# EAGLE design Servorino_FT230X_brick_logic (EAGLE 9.6.2)
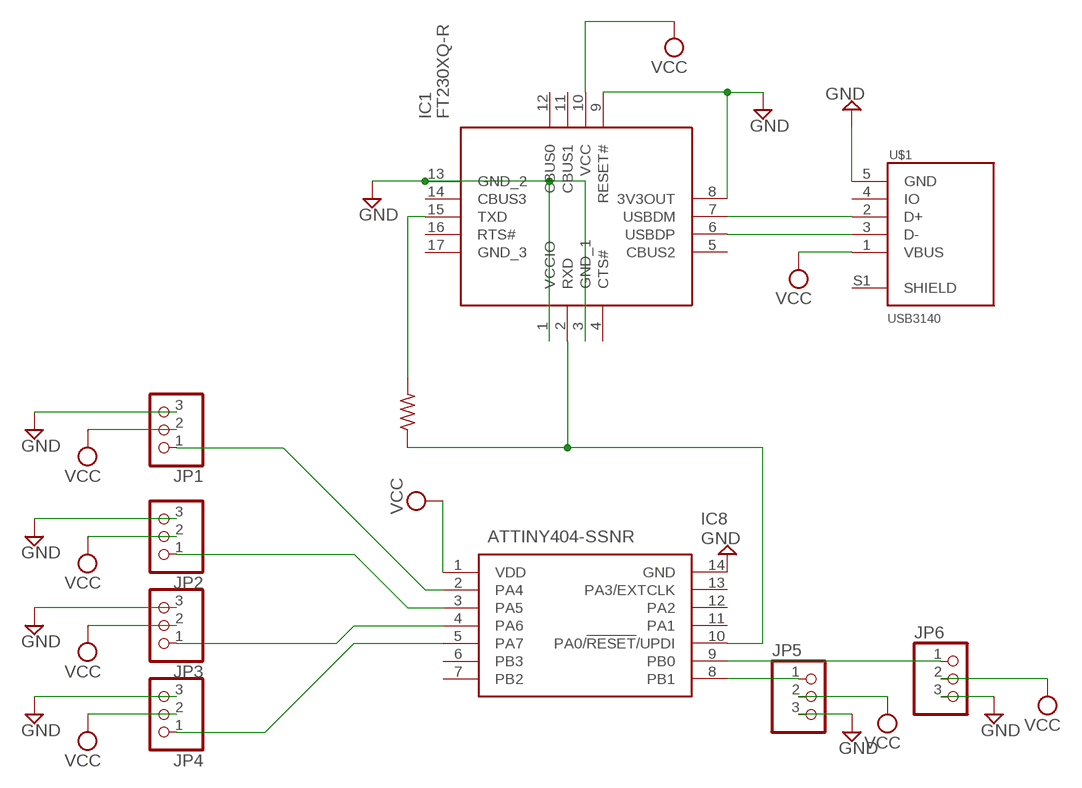
[diagram p0: schematic, sheet 1]

## Parts
IC1  FT230XQ-R  [QFN65P400X400X80-17N]
IC8  ATTINY404-SSNR  [SOIC127P600X175-14N]
JP1  PINHD-1X3  [1X03]
JP2  PINHD-1X3  [1X03]
JP3  PINHD-1X3  [1X03]
JP4  PINHD-1X3  [1X03]
JP5  PINHD-1X3  [1X03]
JP6  PINHD-1X3  [1X03]
R6  470  R-US_R0805  [R0805]
U$1  USB3140  [USB3140-30-0170-0-C]

## Nets
GND: IC1.1(VCCIO) IC1.3(GND_1) IC1.8(3V3OUT) IC1.9(RESET#) IC1.13(GND_2) IC8.14(GND) JP1.3 JP2.3 JP3.3 JP4.3 JP5.3 JP6.3 U$1.5(GND)
N$1: IC8.2(PA4) JP1.1
N$2: IC8.9(PB0) JP6.1
N$3: IC8.8(PB1) JP5.1
N$4: IC8.3(PA5) JP2.1
N$5: IC8.4(PA6) JP3.1
N$6: IC8.5(PA7) JP4.1
N$11: IC1.15(TXD) R6.2
N$12: IC1.6(USBDP) U$1.3(D-)
N$13: IC1.2(RXD) IC8.10(PA0/!RESET!/UPDI) R6.1
N$14: IC1.7(USBDM) U$1.2(D+)
VCC: IC1.10(VCC) IC8.1(VDD) JP1.2 JP2.2 JP3.2 JP4.2 JP5.2 JP6.2 U$1.1(VBUS)
Unconnected: IC1.4(CTS#) IC1.5(CBUS2) IC1.11(CBUS1) IC1.12(CBUS0) IC1.14(CBUS3) IC1.16(RTS#) IC1.17(GND_3) IC8.6(PB3) IC8.7(PB2) IC8.11(PA1) IC8.12(PA2) IC8.13(PA3/EXTCLK) U$1.4(IO) U$1.S1(SHIELD)

## Library data of the parts
IC1 = SamacSys_Parts:FT230XQ-R: X-Chip USB to Basic UART Interface FTDI Chip FT230XQ-R UART Interface 3MBd, 5 V, 16-Pin, QFN Source: Datasheet <https://componentsearchengine.com/Datasheets/1/FT230XQ-R.pdf>; DESCRIPTION: X-Chip USB to Basic UART Interface FTDI Chip FT230XQ-R UART Interface 3MBd, 5 V, 16-Pin, QFN; HEIGHT: 0.8mm; MANUFACTURER_NAME: FTDI Chip; MANUFACTURER_PART_NUMBER: FT230XQ-R; MOUSER_PART_NUMBER: 895-FT230XQ-R; MOUSER_PRICE-STOCK: https://www.mouser.co.uk/ProductDetail/FTDI/FT230XQ-R?qs=Gp1Yz1mis3VvmXwyDmIHOg%3D%3D
IC8 = SamacSys_Parts:ATTINY404-SSNR: MICROCHIP - ATTINY404-SSNR - MCU, 8BIT, 20MHZ, SOIC-14 Source: Datasheet <https://datasheet.datasheetarchive.com/originals/distributors/DKDS-39/8204.pdf>; DESCRIPTION: MICROCHIP - ATTINY404-SSNR - MCU, 8BIT, 20MHZ, SOIC-14; HEIGHT: 1.75mm; MANUFACTURER_NAME: Microchip; MANUFACTURER_PART_NUMBER: ATTINY404-SSNR; MOUSER_PART_NUMBER: 556-ATTINY404-SSNR; MOUSER_PRICE-STOCK: https://www.mouser.co.uk/ProductDetail/Microchip-Technology-Atmel/ATTINY404-SSNR?qs=F5EMLAvA7IAEqD7Aw0z%252B9Q%3D%3D
JP1-JP6 = pinhead:PINHD-1X3: PIN HEADER
R6 = adafruit:R-US_: RESISTOR, American symbol
U$1 = USB:USB3140

## Board
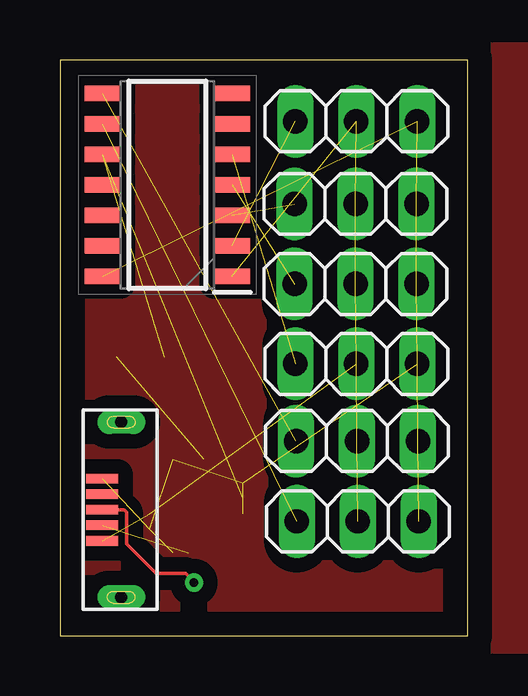
[diagram p1: board, top side]
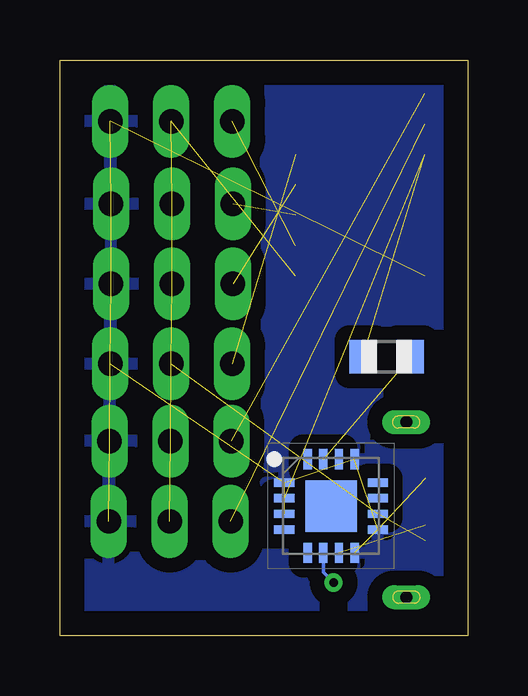
[diagram p2: board, bottom side, seen from below]

Size 17 x 24 mm. Coordinates in mm from the lower left corner, seen from the top.
Outline: 0,0 17,0 17,24 0,24 0,0
Copper layers (1*16): Top 0.035mm / dielectric 1.5mm / Bottom 0.035mm
Design rules "default": minimum track width 6mil, minimum drill 0.35mm, track to track 6mil, track to pad 6mil, pad to pad 6mil, via to via 6mil, smd to smd 6mil, copper to edge 40mil, drill to drill 6mil, minimum pad ring 10mil, minimum via ring 8mil, stop-mask expansion 4mil, vias tented up to drill 0mil, thermal gap 10mil

### Footprints (pad centres in the part's own frame; a part is rotated, then mirrored left to right if it is on the bottom)
QFN65P400X400X80-17N = smd 0.85 x 0.35: 1 -1.95,0.975; 2 -1.95,0.325; 3 -1.95,-0.325; 4 -1.95,-0.975; 9 1.95,-0.975; 10 1.95,-0.325; 11 1.95,0.325; 12 1.95,0.975 | smd 0.35 x 0.85: 5 -0.975,-1.95; 6 -0.325,-1.95; 7 0.325,-1.95; 8 0.975,-1.95; 13 0.975,1.95; 14 0.325,1.95; 15 -0.325,1.95; 16 -0.975,1.95 | smd 2.15 x 2.15: 17 0,0
SOIC127P600X175-14N = smd 1.5 x 0.65: 1 -2.7,3.81; 2 -2.7,2.54; 3 -2.7,1.27; 4 -2.7,0; 5 -2.7,-1.27; 6 -2.7,-2.54; 7 -2.7,-3.81; 8 2.7,-3.81; 9 2.7,-2.54; 10 2.7,-1.27; 11 2.7,0; 12 2.7,1.27; 13 2.7,2.54; 14 2.7,3.81
1X03 = drill 1.016 long: 1 -2.54,0; 2 0,0; 3 2.54,0
R0805 = smd 1.1 x 1.4: 1 -1,0; 2 1,0
USB3140-30-0170-0-C = smd 0.4 x 1.35: 1 -1.3,0; 2 -0.65,0; 3 0,0; 4 0.65,0; 5 1.3,0 | drill 0.5 pad 0.775 long: S1 3.65,-0.8; S3 -3.65,-0.8

### Placement (x,y rotation side)
IC1  5.69,5.4 0 bottom
IC8  4.48,18.79 180 top
JP1  12.36,21.44 0 top
JP2  12.33,18 0 top
JP3  12.33,14.66 0 top
JP4  12.36,11.33 0 top
JP5  12.39,8.11 0 top
JP6  12.42,4.76 0 top
R6  3.37,11.62 0 bottom
U$1  1.76,5.25 90 top

### Tracks (layer width: path | path; a pad name or v marks a point on that pad's centre or on a via)
GND  (12 unrouted)
  pour Bottom (isolate 0.61): -1,25 24.5,25 24.5,-1 -1,-1
N$1  (1 unrouted)
N$2  (1 unrouted)
N$3  (1 unrouted)
N$4  (1 unrouted)
N$5  (1 unrouted)
N$6  (1 unrouted)
N$11  (1 unrouted)
N$12  (via drill 0.35)
  Top 0.152: U$1.3 2.67,5.25 2.78,5.14 2.78,3.82 4.01,2.59 5.24,2.59 5.59,2.24 v5.59,2.21
  Bottom 0.152: v5.59,2.21 6.01,2.63 IC1.6
N$13  (2 unrouted)
N$14  (1 unrouted)
TOPSIGNAL
  pour Top (isolate 0.61): -0.5,24.5 24,24.5 24,-0.5 -0.5,-0.5
VCC  (8 unrouted)